# EAGLE design Trainiii_aux (EAGLE 9.4.2)
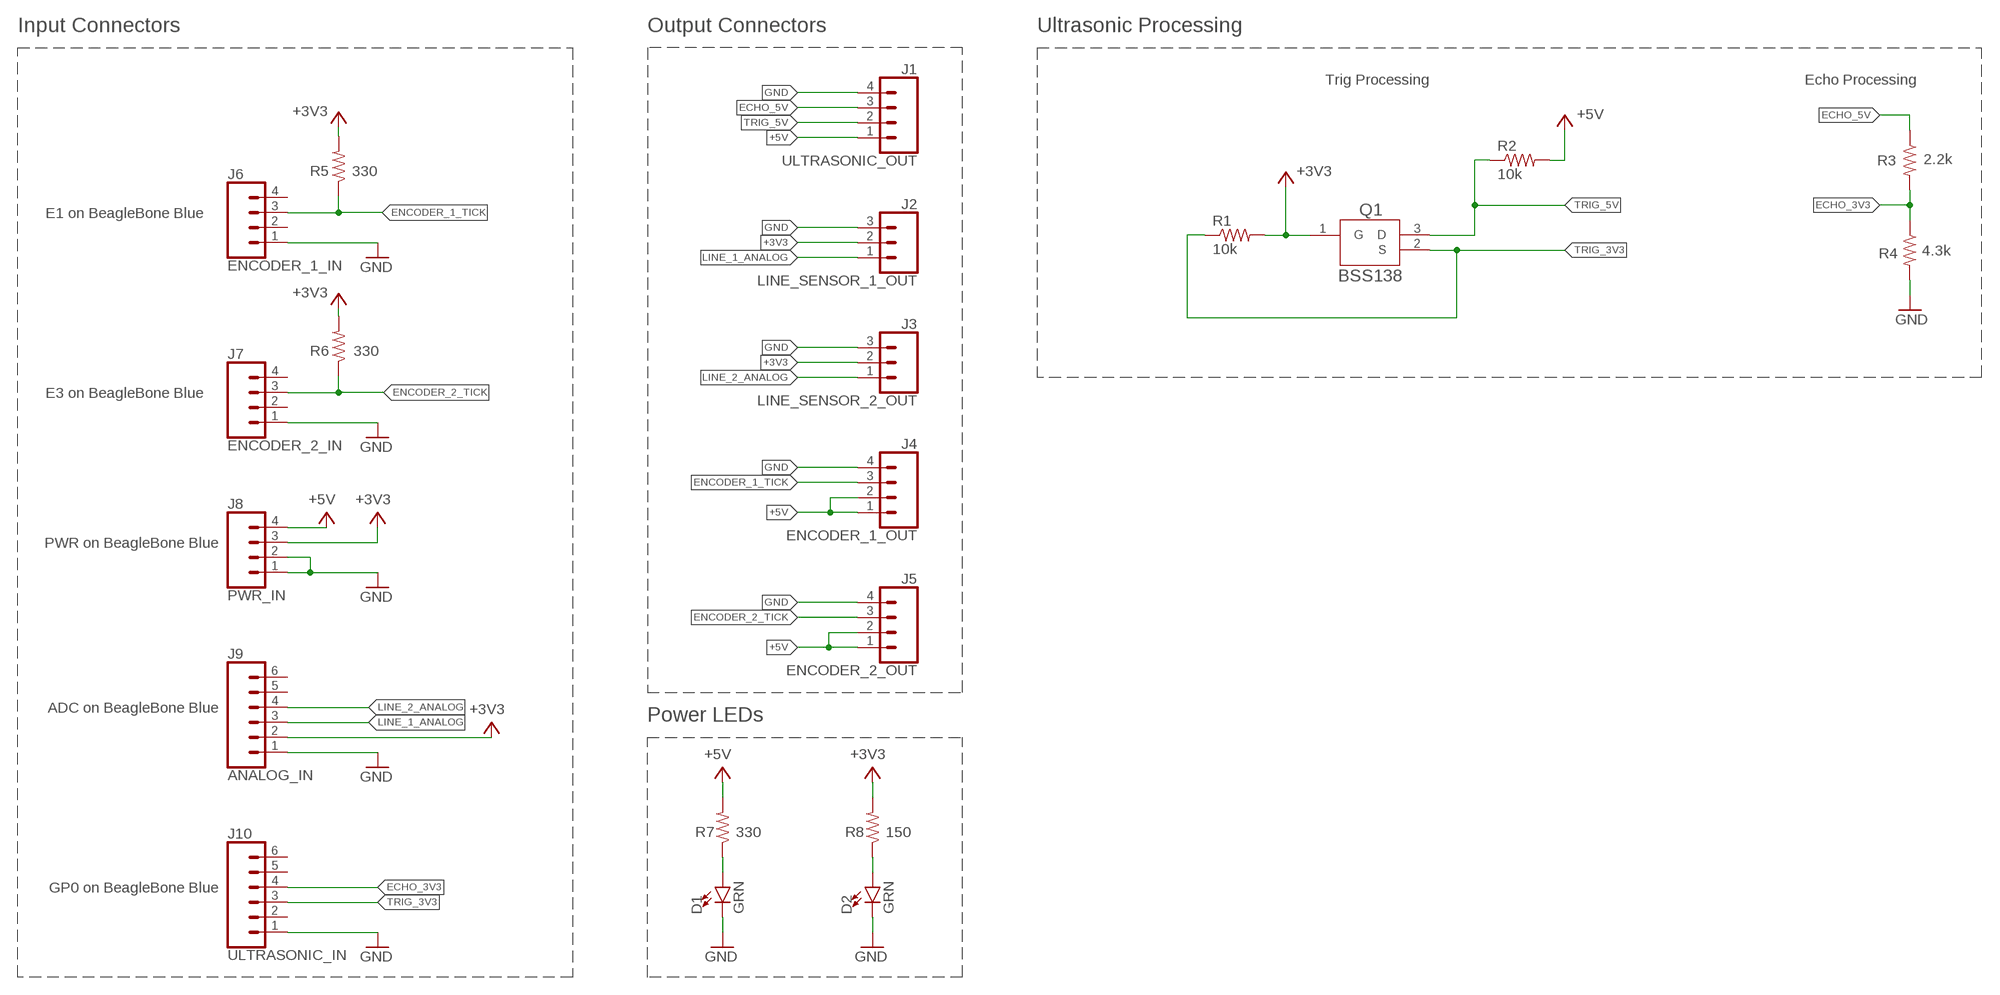
[diagram p0: schematic, sheet 1]

## Parts
D1  GRN  LED0603  [LED-0603]
D2  GRN  LED0603  [LED-0603]
J1  ULTRASONIC_OUT  CONN_04  [1X04]
J2  LINE_SENSOR_1_OUT  CONN_03  [1X03]
J3  LINE_SENSOR_2_OUT  CONN_03  [1X03]
J4  ENCODER_1_OUT  CONN_04  [1X04]
J5  ENCODER_2_OUT  CONN_04  [1X04]
J6  ENCODER_1_IN  CONN_04  [1X04]
J7  ENCODER_2_IN  CONN_04  [1X04]
J8  PWR_IN  CONN_04  [1X04]
J9  ANALOG_IN  CONN_06SILK_FEMALE_PTH  [1X06]
J10  ULTRASONIC_IN  CONN_06SILK_FEMALE_PTH  [1X06]
Q1  BSS138  [SOT-23-3L]
R1  10k  R-US_R0603  [R0603]
R2  10k  R-US_R0603  [R0603]
R3  2.2k  R-US_R0603  [R0603]
R4  4.3k  R-US_R0603  [R0603]
R5  330  R-US_R0603  [R0603]
R6  330  R-US_R0603  [R0603]
R7  330  R-US_R0603  [R0603]
R8  150  R-US_R0603  [R0603]

## Nets
3V3_LED: D2.A R8.1
5V_LED: D1.A R7.1
+3V3: J2.2 J3.2 J8.3 J9.2 Q1.1(G) R1.2 R5.2 R6.2 R8.2
+5V: J1.1 J4.1 J4.2 J5.1 J5.2 J8.4 R2.2 R7.2
ECHO_3V3: J10.4 R3.2 R4.1
ECHO_5V: J1.3 R3.1
ENCODER_1_TICK: J4.3 J6.3 R5.1
ENCODER_2_TICK: J5.3 J7.3 R6.1
GND: D1.C D2.C J1.4 J2.3 J3.3 J4.4 J5.4 J6.1 J7.1 J8.1 J8.2 J9.1 J10.1 R4.2
LINE_1_ANALOG: J2.1 J9.3
LINE_2_ANALOG: J3.1 J9.4
TRIG_3V3: J10.3 Q1.2(S) R1.1
TRIG_5V: J1.2 Q1.3(D) R2.1
Unconnected: J6.2 J6.4 J7.2 J7.4 J9.5 J9.6 J10.2 J10.5 J10.6

## Notes on the sheet
- Input Connectors | Output Connectors | Ultrasonic Processing
- Trig Processing | Echo Processing
- E1 on BeagleBone Blue
- E3 on BeagleBone Blue
- PWR on BeagleBone Blue
- ADC on BeagleBone Blue
- Power LEDs
- GP0 on BeagleBone Blue

## Library data of the parts
D1 D2 = SparkFun-LED:LED: LED (Generic) Standard schematic elements and footprints for 5mm, 3mm, 1206, and 0603 sized LEDs. Generic LEDs with no color specified.
J1 J4-J8 = SparkFun-Connectors:CONN_04: Multi connection point. Often used as Generic Header-pin footprint for 0.1 inch spaced/style header connections On any of the 0.1 inch spaced packages, you can populate with these: Break Away Headers - Straight <https://www.sparkfun.com/products/116> (PRT-00116) Break Away Male Headers - Right Angle <https://www.sparkfun.com/products/553> (PRT-00553) Female Headers <https://www.sparkfun.com/products/115> (PRT-00115) Break Away Headers - Machine Pin <https://www.sparkfun.com/products/117> (PRT-00117) Break Away Female Headers - Swiss Machine Pin <https://www.sparkfun.com/products/743> (PRT-00743) For SCREWTERMINALS and SPRING TERMINALS visit here: Screw Terimnals on SparkFun.com <https://www.sparkfun.com/search/results?term=Screw+Terminals> (5mm/3.5mm/2.54mm spacing) This device is also useful as a general connection point to wire up your design to another part of your project. Our various solder wires solder well into these plated through hole pads. Hook-Up Wire - Assortment (Stranded, 22 AWG) <https://www.sparkfun.com/products/11375> (PRT-11375) Hook-Up Wire - Assortment (Solid Core, 22 AWG) <https://www.sparkfun.com/products/11367> (PRT-11367) View the entire wire category on our website here <https://www.sparkfun.com/categories/141> Special notes: Molex polarized connector foot print use with SKU : PRT-08231 with associated crimp pins and housings. 1MM SMD Version SKU: PRT-10208; PROD_ID: CONN-09696
J2 J3 = SparkFun-Connectors:CONN_03: Multi connection point. Often used as Generic Header-pin footprint for 0.1 inch spaced/style header connections On any of the 0.1 inch spaced packages, you can populate with these: Break Away Headers - Straight <https://www.sparkfun.com/products/116> (PRT-00116) Break Away Male Headers - Right Angle <https://www.sparkfun.com/products/553> (PRT-00553) Female Headers <https://www.sparkfun.com/products/115> (PRT-00115) Break Away Headers - Machine Pin <https://www.sparkfun.com/products/117> (PRT-00117) Break Away Female Headers - Swiss Machine Pin <https://www.sparkfun.com/products/743> (PRT-00743) Stackable Header - 3 Pin (Female, 0.1") <https://www.sparkfun.com/products/13875> (PRT-13875) For SCREWTERMINALS and SPRING TERMINALS visit here: Screw Terimnals on SparkFun.com <https://www.sparkfun.com/search/results?term=Screw+Terminals> (5mm/3.5mm/2.54mm spacing) This device is also useful as a general connection point to wire up your design to another part of your project. Our various solder wires solder well into these plated through hole pads. Hook-Up Wire - Assortment (Stranded, 22 AWG) <https://www.sparkfun.com/products/11375> (PRT-11375) Hook-Up Wire - Assortment (Solid Core, 22 AWG) <https://www.sparkfun.com/products/11367> (PRT-11367) View the entire wire category on our website here <https://www.sparkfun.com/categories/141> Special notes: Molex polarized connector foot print use with SKU : PRT-08232 with associated crimp pins and housings.
J9 J10 = SparkFun-Connectors:CONN_06: Multi connection point. Often used as Generic Header-pin footprint for 0.1 inch spaced/style header connections On any of the 0.1 inch spaced packages, you can populate with these: Break Away Headers - Straight <https://www.sparkfun.com/products/116> (PRT-00116) Break Away Male Headers - Right Angle <https://www.sparkfun.com/products/553> (PRT-00553) Female Headers <https://www.sparkfun.com/products/115> (PRT-00115) Break Away Headers - Machine Pin <https://www.sparkfun.com/products/117> (PRT-00117) Break Away Female Headers - Swiss Machine Pin <https://www.sparkfun.com/products/743> (PRT-00743) Arduino Stackable Header - 6 Pin <https://www.sparkfun.com/products/9280> (PRT-09280) For SCREWTERMINALS and SPRING TERMINALS visit here: Screw Terimnals on SparkFun.com <https://www.sparkfun.com/search/results?term=Screw+Terminals> (5mm/3.5mm/2.54mm spacing) This device is also useful as a general connection point to wire up your design to another part of your project. Our various solder wires solder well into these plated through hole pads. Hook-Up Wire - Assortment (Stranded, 22 AWG) <https://www.sparkfun.com/products/11375> (PRT-11375) Hook-Up Wire - Assortment (Solid Core, 22 AWG) <https://www.sparkfun.com/products/11367> (PRT-11367) View the entire wire category on our website here <https://www.sparkfun.com/categories/141>; PROD_ID: CONN-08437
Q1 = Trainiii_aux:BSS138; MANUFACTURER_PART_NUMBER: BSS138; VENDOR: Fairchild Semiconductor
R1-R8 = rcl:R-US_: RESISTOR, American symbol; SPICEPREFIX: R

## Board
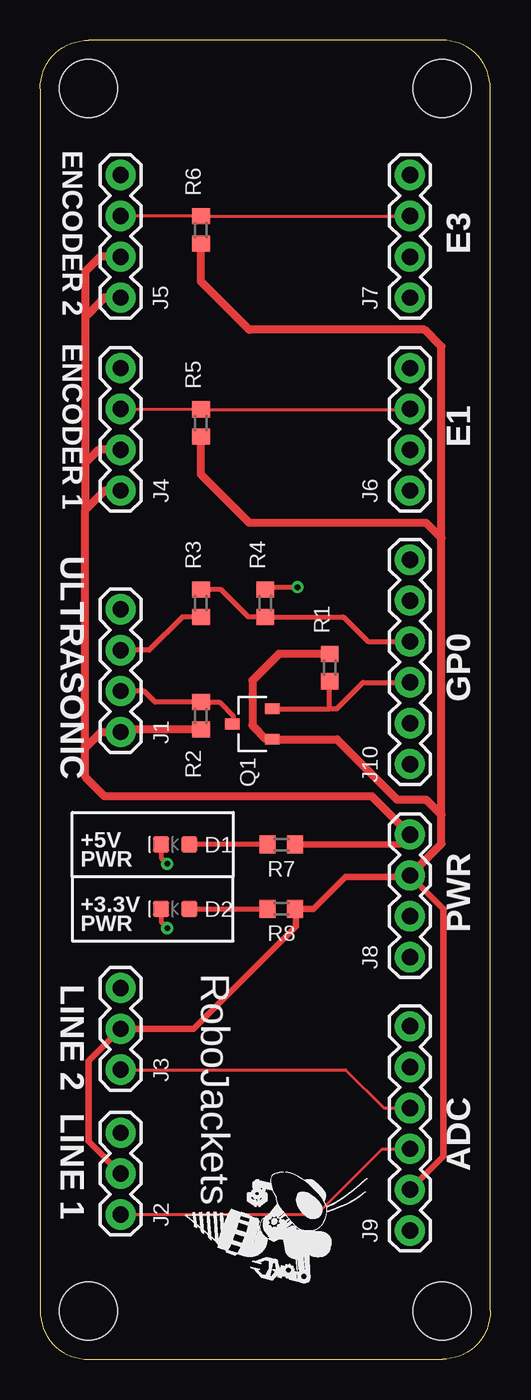
[diagram p1: board, top side]
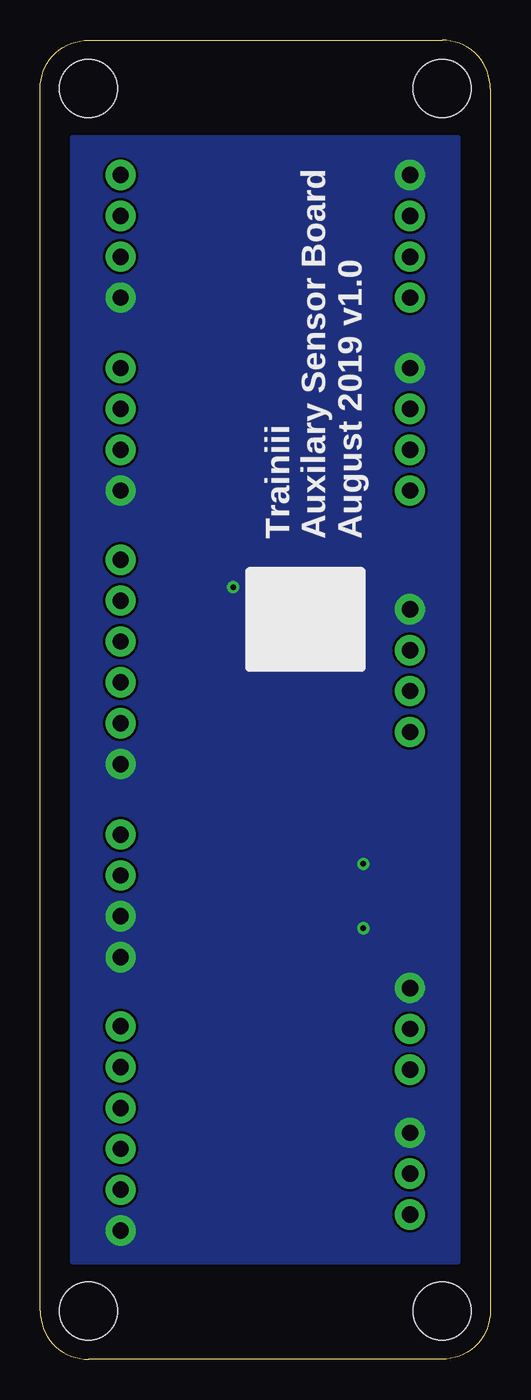
[diagram p2: board, bottom side, seen from below]

Size 28 x 82 mm. Coordinates in mm from the lower left corner, seen from the top.
Outline: 3,0 25,0 arc90 28,3 28,79 arc90 25,82 3,82 arc90 0,79 0,3 arc90 3,0
Copper layers (1*16): Top 0.035mm / dielectric 1.5mm / Bottom 0.035mm
Design rules "default": minimum track width 6mil, minimum drill 0.35mm, track to track 6mil, track to pad 6mil, pad to pad 6mil, via to via 6mil, smd to smd 6mil, copper to edge 40mil, drill to drill 6mil, minimum pad ring 10mil, minimum via ring 8mil, stop-mask expansion 4mil, vias tented up to drill 0mil, thermal gap 10mil
Holes 3.6 mm at 3,3 25,3 3,79 25,79

### Footprints (pad centres in the part's own frame; a part is rotated, then mirrored left to right if it is on the bottom)
LED-0603 = smd 1 x 1: A -0.877,0; C 0.877,0
1X04 = drill 1.016 pad 1.88: 1 0,0; 2 2.54,0; 3 5.08,0; 4 7.62,0
1X03 = drill 1.016 pad 1.88: 1 0,0; 2 2.54,0; 3 5.08,0
1X06 = drill 1.016 pad 1.88: 1 0,0; 2 2.54,0; 3 5.08,0; 4 7.62,0; 5 10.16,0; 6 12.7,0
SOT-23-3L = smd 0.66 x 0.914: 1 -0.95,-1.245; 2 0.95,-1.245; 3 0,1.245
R0603 = smd 1 x 1.1: 1 -0.85,0; 2 0.85,0

### Placement (x,y rotation side)
D1  8.4,32 180 top
D2  8.4,28 180 top
J1  5,39 90 top
J2  5,9 90 top
J3  5,18 90 top
J4  5,54 90 top
J5  5,66 90 top
J6  23,54 90 top
J7  23,66 90 top
J8  23,25 90 top
J9  23,8 90 top
J10  23,37 90 top
Q1  13.19,39.49 90 top
R1  18,43 90 top
R2  10,40 270 top
R3  10,47 90 top
R4  14,47 90 top
R5  10,58.2 270 top
R6  10,70.2 270 top
R7  15,32 0 top
R8  15,28 0 top
U$1  [ROBOBUZZ_0.6X]  9,9 270 top

### Tracks (layer width: path | path; a pad name or v marks a point on that pad's centre or on a via)
3V3_LED
  Top 0.3: D2.A R8.1
5V_LED
  Top 0.3: R7.1 D1.A
+3V3
  Top 0.4: J9.2 25.08,12.62 25.08,28 J8.3 22.92,30 19,30 17,28 R8.2 15.9,27.95 15.9,26.9 9.54,20.54 J3.2 3,18.54 3,13.54 J2.2
  Top 0.5: J8.3 24.96,32.04 24.96,33.84 | 24.96,33.84 24,34.8 22.2,34.8 18.46,38.54 Q1.1 14.06,38.54 13.2,39.4 13.2,42.2 14.85,43.85 R1.2 | R6.2 10,67 13,64 23.92,64 24.96,62.96 24.96,51.04 | 24.96,33.84 24.96,51.04 | R5.2 10,55 13,52 24,52 24.96,51.04
+5V
  Top 0.4: J8.4 22.38,32 R7.2
  Top 0.5: J8.4 20.62,35 4,35 2.8,36.2 2.8,38 | R2.2 5.15,39.15 J1.1 3.8,39 2.8,38 | 2.8,38 2.8,52.8 | J4.2 3.64,56.54 2.8,55.7 | 2.8,55.7 2.8,52.8 | J5.1 4,66 2.8,64.8 | 2.8,64.8 2.8,55.7 | J4.1 4,54 2.8,52.8 | J5.2 3.74,68.54 2.8,67.6 2.8,64.8
ECHO_3V3
  Top 0.3: R3.2 11.25,47.85 12.95,46.15 R4.1 18.85,46.15 20.38,44.62 J10.4
ECHO_5V
  Top 0.3: R3.1 8.85,46.15 6.78,44.08 J1.3
ENCODER_1_TICK
  Top 0.2: J4.3 9.97,59.08 R5.1 22.97,59.05 J6.3
ENCODER_2_TICK
  Top 0.2: J5.3 9.97,71.08 R6.1 22.97,71.05 J7.3
GND  (via drill 0.35, 0.35 pad 0.65)
  Top 0.3: D1.C 7.52,31.18 v7.9,30.8 | D2.C 7.52,27.18 v7.9,26.8 | R4.2 14.15,48 v16,48
  pour Bottom (no thermals): 2,6 26,6 26,76 2,76
LINE_1_ANALOG
  Top 0.2: J2.1 17.2,9 21.28,13.08 J9.3
LINE_2_ANALOG
  Top 0.2: J3.1 19,18 21.38,15.62 J9.4
TRIG_3V3
  Top 0.3: Q1.2 18,40.44 | 18,40.44 18.44,40.44 20.08,42.08 J10.3 | 18,40.44 R1.1
TRIG_5V
  Top 0.3: J1.2 6.46,41.54 7.15,40.85 R2.1 11.15,40.85 12,40 12,39.55 Q1.3

### Text on the board
tPlace: ENCODER 2 | E3 | ENCODER 1 | E1 | ULTRASONIC | GP0 | +5V / PWR | PWR | +3.3V / PWR | RoboJackets | LINE 2 | ADC | LINE 1
bPlace: Trainiii / Auxilary Sensor Board / August 2019 v1.0